# Altium schematic sheet input.SchDoc
size A4
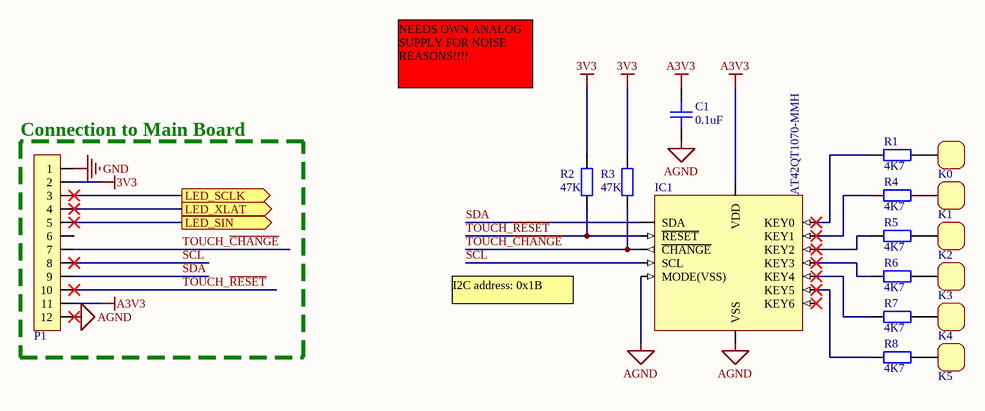
[diagram p0: input.SchDoc]

## Parts
C1  0.1uF  [1608[0603]_M]
IC1  AT42QT1070-MMH  [VQFN-20-EXPOSED-PAD_M]
K0  SELF-CAP-TOUCH-SENSOR-PAD  [TOUCH_SENSOR_SEED]  (value not drawn)
K1  SELF-CAP-TOUCH-SENSOR-PAD  [TOUCH_SENSOR_SEED]  (value not drawn)
K2  SELF-CAP-TOUCH-SENSOR-PAD  [TOUCH_SENSOR_SEED]  (value not drawn)
K3  SELF-CAP-TOUCH-SENSOR-PAD  [TOUCH_SENSOR_SEED]  (value not drawn)
K4  SELF-CAP-TOUCH-SENSOR-PAD  [TOUCH_SENSOR_SEED]  (value not drawn)
K5  SELF-CAP-TOUCH-SENSOR-PAD  [TOUCH_SENSOR_SEED]  (value not drawn)
P1  Connector 12  [FH33-12S-0.5SH_N]  (value not drawn)
R1  4K7  [1608[0603]_M]
R2  47K  [1608[0603]_M]
R3  47K  [1608[0603]_M]
R4  4K7  [1608[0603]_M]
R5  4K7  [1608[0603]_M]
R6  4K7  [1608[0603]_M]
R7  4K7  [1608[0603]_M]
R8  4K7  [1608[0603]_M]

## Blocks framed on the sheet
Connection to Main Board: P1

## Ports
LED_SCLK (out), LED_SIN (out), LED_XLAT (out)

## Nets
3V3: P1.2 R2.2 R3.2
A3V3: C1.2 IC1.9(VDD) P1.11
AGND: C1.1 IC1.8(VSS) IC1.11(MODE(VSS)) P1.12
GND: P1.1
LED_SCLK: P1.3 ; port LED_SCLK
LED_SIN: P1.5 ; port LED_SIN
LED_XLAT: P1.4 ; port LED_XLAT
SCL: IC1.15(SCL) P1.8
SDA: IC1.12(SDA) P1.9
TOUCH_~{CHANGE}: IC1.14(~{CHANGE}) P1.7 R3.1
TOUCH_~{RESET}: IC1.13(~{RESET}) P1.10 R2.1
NetIC1_1: IC1.1(KEY4) R7.2
NetIC1_2: IC1.2(KEY3) R6.2
NetIC1_3: IC1.3(KEY2) R5.2
NetIC1_4: IC1.4(KEY1) R4.2
NetIC1_5: IC1.5(KEY0) R1.2
NetIC1_17: IC1.17(KEY5) R8.2
NetK0_1: K0.1 R1.1
NetK1_1: K1.1 R4.1
NetK2_1: K2.1 R5.1
NetK3_1: K3.1 R6.1
NetK4_1: K4.1 R7.1
NetK5_1: K5.1 R8.1

Not connected (* = marked no-connect by the designer): IC1 16(KEY6)*; P1 6

## Notes on the sheet
- NEEDS OWN ANALOG SUPPLY FOR NOISE REASONS!!!!
- I2C address: 0x1B

## Library data of the parts
C1 = Capacitor: Generic Capacitor; Value: 0.1uF
IC1 = AT42QT1070: Seven-channel capacitive touch sensor (Comms mode)
K0-K5 = SELF-CAP-TOUCH-SENSOR-PAD: Generic self-capacitance touch sensor pad
P1 = Connector 12: Connector 12-Pin
R1-R8 = Resistor: Generic Resistor
  R1 R4-R8: Value: 4K7
  R2 R3: Value: 47K